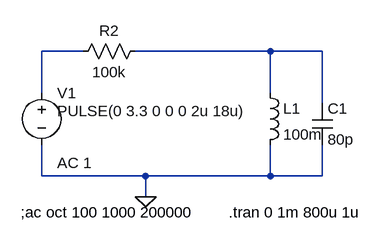
[diagram p0: schematic filter1.asc]
filter1.asc, the LTspice schematic file:
Version 4
SHEET 1 880 680
WIRE 80 64 16 64
WIRE 368 64 160 64
WIRE 448 64 368 64
WIRE 16 128 16 64
WIRE 368 128 368 64
WIRE 448 144 448 64
WIRE 16 256 16 208
WIRE 176 256 16 256
WIRE 368 256 368 208
WIRE 368 256 176 256
WIRE 448 256 448 208
WIRE 448 256 368 256
WIRE 176 288 176 256
FLAG 176 288 0
SYMBOL voltage 16 112 R0
WINDOW 123 24 124 Left 2
WINDOW 39 0 0 Left 2
WINDOW 3 24 44 Left 2
SYMATTR Value2 AC 1
SYMATTR Value PULSE(0 3.3 0 0 0 2u 18u)
SYMATTR InstName V1
SYMBOL res 176 48 R90
WINDOW 0 0 56 VBottom 2
WINDOW 3 32 56 VTop 2
SYMATTR InstName R2
SYMATTR Value 100k
SYMBOL cap 432 144 R0
SYMATTR InstName C1
SYMATTR Value 80p
SYMBOL ind 352 112 R0
SYMATTR InstName L1
SYMATTR Value 100m
TEXT -16 312 Left 2 !;ac oct 100 1000 200000
TEXT 304 312 Left 2 !.tran 0 1m 800u 1u

The netlist it stands for:
* filter1.asc
V1 N001 0 PULSE(0 3.3 0 0 0 2u 18u) AC 1
R2 N002 N001 100k
C1 N002 0 80p
L1 N002 0 100m
;ac oct 100 1000 200000
.tran 0 1m 800u 1u
.backanno
.end